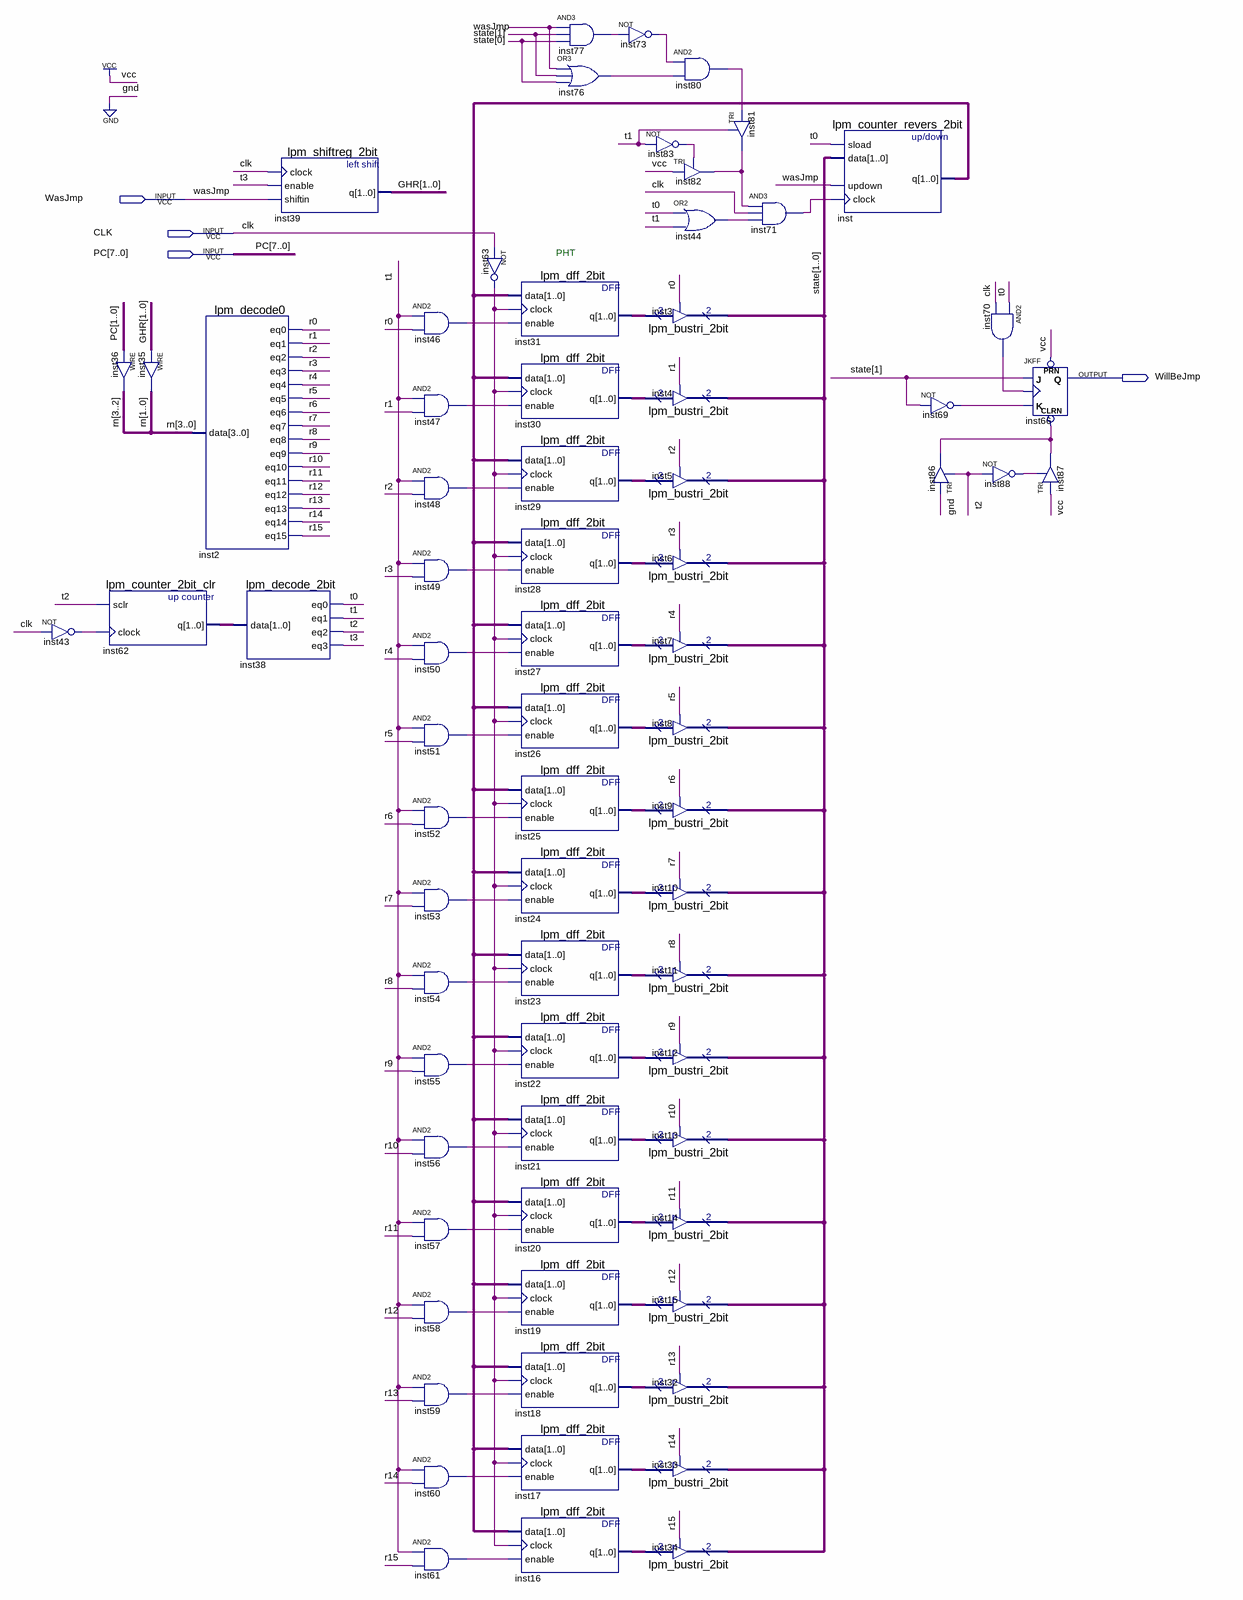
[diagram p0: schematic sheet]
// Quartus schematic Predictor.bdf as structural Verilog: 72 symbols, 4 pins
module Predictor (
  input  WasJmp,
  input  CLK,
  input  [7:0] PC,
  output WillBeJmp
);

  wire inst43_out, inst44_out, inst46_out, inst47_out, inst48_out, inst49_out, inst50_out, inst51_out,
       inst52_out, inst53_out, inst54_out, inst55_out, inst56_out, inst57_out, inst58_out, inst59_out,
       inst60_out, inst61_out, inst63_out, inst69_out, inst70_out, inst71_out, inst73_out, inst76_out,
       inst77_out, inst80_out, inst82_out, inst83_out, inst86_out, inst88_out, r0, r1, r2, r3, r4, r5, r6,
       r7, r8, r9, r10, r11, r12, r13, r14, r15, t0, t1, t2, t3;
  wire [1:0] GHR, inst16_q, inst17_q, inst18_q, inst19_q, inst20_q, inst21_q, inst22_q, inst23_q, inst24_q,
       inst25_q, inst26_q, inst27_q, inst28_q, inst29_q, inst30_q, inst31_q, inst62_q, inst_q, state;
  wire [3:0] rn;

  not inst43 (inst43_out, CLK);
  lpm_counter_2bit_clr inst62 (.sclr(t2), .clock(inst43_out), .q(inst62_q));
  assign rn[1:0] = GHR;  // WIRE inst35
  assign rn[3:2] = PC[1:0];  // WIRE inst36
  lpm_decode0 inst2 (
    .data(rn), .eq0(r0), .eq1(r1), .eq2(r2), .eq3(r3), .eq4(r4), .eq5(r5), .eq6(r6), .eq7(r7), .eq8(r8),
    .eq9(r9), .eq10(r10), .eq11(r11), .eq12(r12), .eq13(r13), .eq14(r14), .eq15(r15));
  lpm_decode_2bit inst38 (.data(inst62_q), .eq0(t0), .eq1(t1), .eq2(t2), .eq3(t3));
  lpm_shiftreg_2bit inst39 (.clock(CLK), .enable(t3), .shiftin(WasJmp), .q(GHR));
  and inst46 (inst46_out, t1, r0);
  and inst47 (inst47_out, t1, r1);
  and inst48 (inst48_out, t1, r2);
  and inst49 (inst49_out, t1, r3);
  and inst50 (inst50_out, t1, r4);
  and inst51 (inst51_out, t1, r5);
  and inst52 (inst52_out, t1, r6);
  and inst53 (inst53_out, t1, r7);
  and inst54 (inst54_out, t1, r8);
  and inst55 (inst55_out, t1, r9);
  and inst56 (inst56_out, t1, r10);
  and inst57 (inst57_out, t1, r11);
  and inst58 (inst58_out, t1, r12);
  and inst59 (inst59_out, t1, r13);
  and inst60 (inst60_out, t1, r14);
  and inst61 (inst61_out, t1, r15);
  not inst63 (inst63_out, CLK);
  lpm_dff_2bit inst31 (.data(inst_q), .clock(inst63_out), .enable(inst46_out), .q(inst31_q));
  lpm_dff_2bit inst30 (.data(inst_q), .clock(inst63_out), .enable(inst47_out), .q(inst30_q));
  lpm_dff_2bit inst29 (.data(inst_q), .clock(inst63_out), .enable(inst48_out), .q(inst29_q));
  lpm_dff_2bit inst28 (.data(inst_q), .clock(inst63_out), .enable(inst49_out), .q(inst28_q));
  lpm_dff_2bit inst27 (.data(inst_q), .clock(inst63_out), .enable(inst50_out), .q(inst27_q));
  lpm_dff_2bit inst26 (.data(inst_q), .clock(inst63_out), .enable(inst51_out), .q(inst26_q));
  lpm_dff_2bit inst25 (.data(inst_q), .clock(inst63_out), .enable(inst52_out), .q(inst25_q));
  lpm_dff_2bit inst24 (.data(inst_q), .clock(inst63_out), .enable(inst53_out), .q(inst24_q));
  lpm_dff_2bit inst23 (.data(inst_q), .clock(inst63_out), .enable(inst54_out), .q(inst23_q));
  lpm_dff_2bit inst22 (.data(inst_q), .clock(inst63_out), .enable(inst55_out), .q(inst22_q));
  lpm_dff_2bit inst21 (.data(inst_q), .clock(inst63_out), .enable(inst56_out), .q(inst21_q));
  lpm_dff_2bit inst20 (.data(inst_q), .clock(inst63_out), .enable(inst57_out), .q(inst20_q));
  lpm_dff_2bit inst19 (.data(inst_q), .clock(inst63_out), .enable(inst58_out), .q(inst19_q));
  lpm_dff_2bit inst18 (.data(inst_q), .clock(inst63_out), .enable(inst59_out), .q(inst18_q));
  lpm_dff_2bit inst17 (.data(inst_q), .clock(inst63_out), .enable(inst60_out), .q(inst17_q));
  lpm_dff_2bit inst16 (.data(inst_q), .clock(inst63_out), .enable(inst61_out), .q(inst16_q));
  and inst77 (inst77_out, WasJmp, state[1], state[0]);
  or inst76 (inst76_out, WasJmp, state[1], state[0]);
  not inst73 (inst73_out, inst77_out);
  not inst83 (inst83_out, t1);
  lpm_bustri_2bit inst3 (.enabledt(r0), .data(inst31_q), .tridata(state));
  lpm_bustri_2bit inst4 (.enabledt(r1), .data(inst30_q), .tridata(state));
  lpm_bustri_2bit inst5 (.enabledt(r2), .data(inst29_q), .tridata(state));
  lpm_bustri_2bit inst6 (.enabledt(r3), .data(inst28_q), .tridata(state));
  lpm_bustri_2bit inst7 (.enabledt(r4), .data(inst27_q), .tridata(state));
  lpm_bustri_2bit inst8 (.enabledt(r5), .data(inst26_q), .tridata(state));
  lpm_bustri_2bit inst9 (.enabledt(r6), .data(inst25_q), .tridata(state));
  lpm_bustri_2bit inst10 (.enabledt(r7), .data(inst24_q), .tridata(state));
  lpm_bustri_2bit inst11 (.enabledt(r8), .data(inst23_q), .tridata(state));
  lpm_bustri_2bit inst12 (.enabledt(r9), .data(inst22_q), .tridata(state));
  lpm_bustri_2bit inst13 (.enabledt(r10), .data(inst21_q), .tridata(state));
  lpm_bustri_2bit inst14 (.enabledt(r11), .data(inst20_q), .tridata(state));
  lpm_bustri_2bit inst15 (.enabledt(r12), .data(inst19_q), .tridata(state));
  lpm_bustri_2bit inst32 (.enabledt(r13), .data(inst18_q), .tridata(state));
  lpm_bustri_2bit inst33 (.enabledt(r14), .data(inst17_q), .tridata(state));
  lpm_bustri_2bit inst34 (.enabledt(r15), .data(inst16_q), .tridata(state));
  and inst80 (inst80_out, inst73_out, inst76_out);
  TRI inst82 (.IN(1'b1), .OE(inst83_out), .OUT(inst82_out));
  or inst44 (inst44_out, t0, t1);
  TRI inst81 (.IN(inst80_out), .OE(t1), .OUT(inst82_out));
  and inst71 (inst71_out, inst82_out, CLK, inst44_out);
  lpm_counter_revers_2bit inst (.sload(t0), .data(state), .updown(WasJmp), .clock(inst71_out), .q(inst_q));
  not inst69 (inst69_out, state[1]);
  TRI inst86 (.IN(1'b0), .OE(t2), .OUT(inst86_out));
  and inst70 (inst70_out, t0, CLK);
  JKFF inst66 (.PRN(1'b1), .CLRN(inst86_out), .K(inst69_out), .J(state[1]), .CLK(inst70_out), .Q(WillBeJmp));
  not inst88 (inst88_out, t2);
  TRI inst87 (.IN(1'b1), .OE(inst88_out), .OUT(inst86_out));

  // Notes on the sheet:
  //   PHT
endmodule
